# EAGLE design audio (EAGLE 8.6.0)
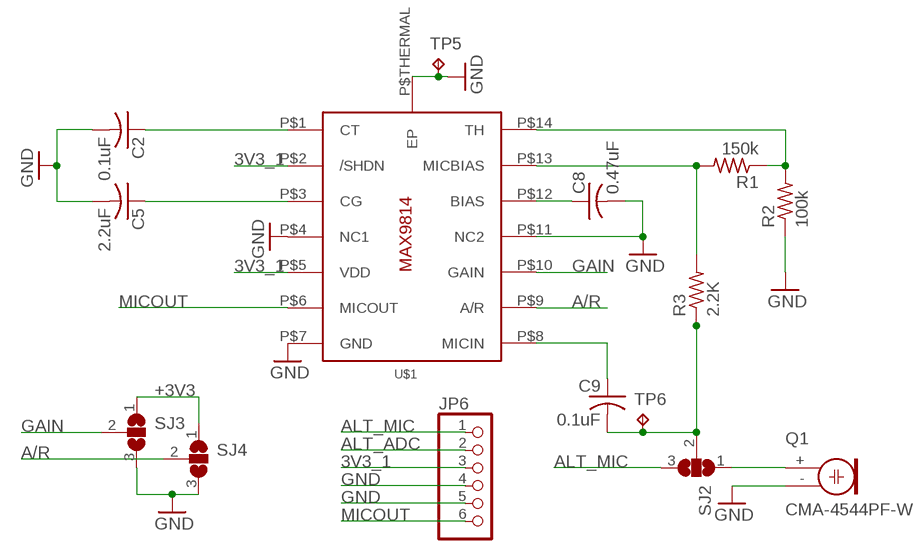
[diagram p0: schematic, sheet 1]

## Parts
C2  0.1uF  C-USC0805K  [C0805K]
C5  2.2uF  C-USC0805K  [C0805K]
C8  0.47uF  C-USC0805K  [C0805K]
C9  0.1uF  C-USC0805K  [C0805K]
JP6  PINHD-1X6  [1X06]
Q1  CMA-4544PF-W  ELECTRET  [9.7ELECTRET]
R1  150k  R-US_R0805  [R0805]
R2  100k  R-US_R0805  [R0805]
R3  2.2K  R-US_R0805  [R0805]
SJ2  SJ2W  [SJ_2]
SJ3  SJ2W  [SJ_2]
SJ4  SJ2W  [SJ_2]
TP5  TPB1,27  [B1,27]
TP6  TPB1,27  [B1,27]
U$1  MAX9814TDFN14  [TDFN14_3X3MM]

## Nets
3V3_1: JP6.3 U$1.P$2(/SHDN) U$1.P$5(VDD)
+3V3: SJ3.1 SJ4.1
A/R: SJ4.2 U$1.P$9(A/R)
ALT_ADC: JP6.2
ALT_MIC: JP6.1 SJ2.3
GAIN: SJ3.2 U$1.P$10(GAIN)
GND: C2.2 C5.2 C8.2 JP6.4 JP6.5 Q1.- R2.1 SJ3.3 SJ4.3 TP5.TP U$1.P$4(NC1) U$1.P$7(GND) U$1.P$11(NC2) U$1.P$THERMAL(EP)
INPUT: C9.2 R3.1 SJ2.2 TP6.TP
MICOUT: JP6.6 U$1.P$6(MICOUT)
N$5: C9.1 U$1.P$8(MICIN)
N$7: C8.1 U$1.P$12(BIAS)
N$8: C2.1 U$1.P$1(CT)
N$9: C5.1 U$1.P$3(CG)
N$10: R1.1 R2.2 U$1.P$14(TH)
N$11: R1.2 R3.2 U$1.P$13(MICBIAS)
N$33: Q1.+ SJ2.1

## Library data of the parts
C2 C5 C8 C9 = adafruit:C-US: CAPACITOR, American symbol
JP6 = adafruit:PINHD-1X6: PIN HEADER
Q1 = adafruit:ELECTRET: Electret microphone Thru hole 2.54mm spacing with 9.7mm diameter
R1-R3 = adafruit:R-US_: RESISTOR, American symbol
SJ2-SJ4 = jumper:SJ2W: SMD solder JUMPER
TP5 TP6 = testpad:TP: Test pad
U$1 = adafruit:MAX9814

## Net classes
0 default: clearance 0.205 mm

## Board
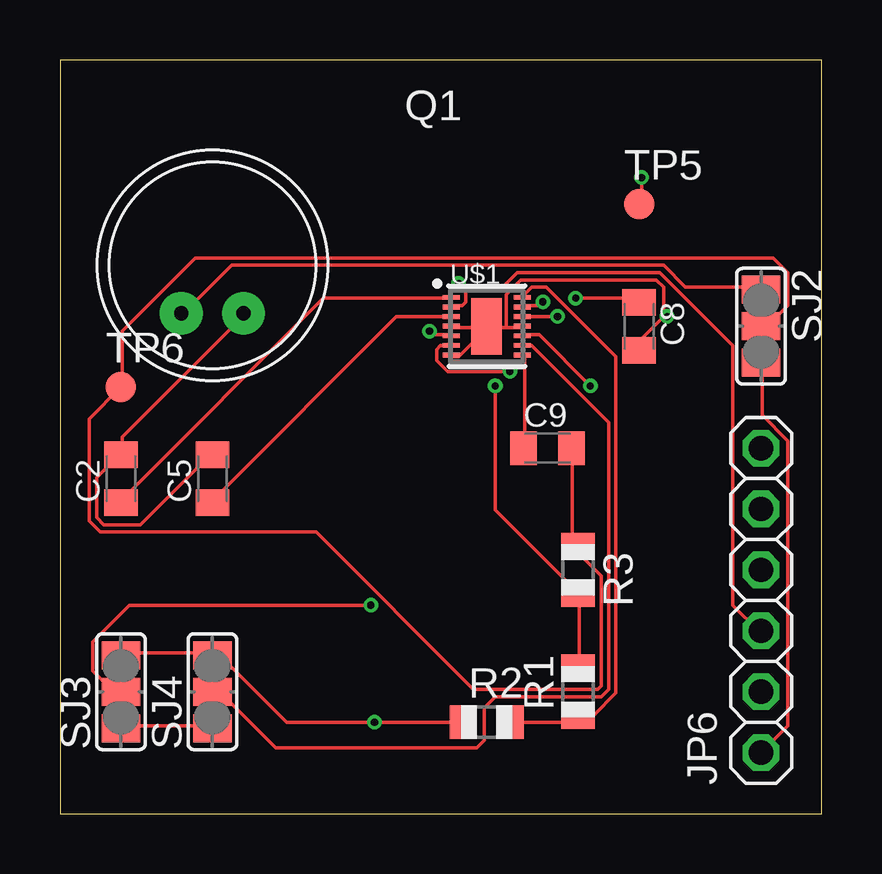
[diagram p1: board, top side]
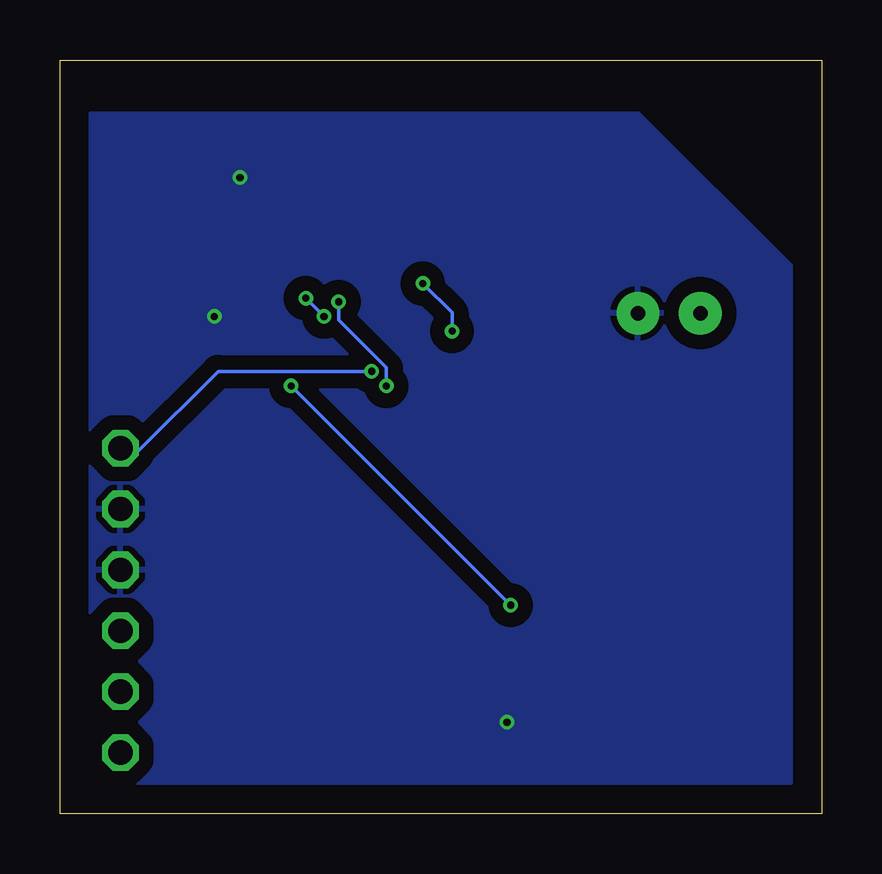
[diagram p2: board, bottom side, seen from below]

Size 31.73 x 31.42 mm. Coordinates in mm from the lower left corner, seen from the top.
Outline: 0,0 31.73,0 31.73,31.42 0,31.42 0,0
Copper layers (1*16): Top 0.035mm / dielectric 1.5mm / Bottom 0.035mm
Design rules "PCBWay_2layer": minimum track width 6mil, minimum drill 0.3mm, track to track 6mil, track to pad 6mil, pad to pad 6mil, via to via 6mil, smd to smd 4mil, copper to edge 10mil, drill to drill 6mil, minimum pad ring 6mil, minimum via ring 6mil, stop-mask expansion 4mil, vias tented up to drill 0.8mm, thermal gap 10mil

### Footprints (pad centres in the part's own frame; a part is rotated, then mirrored left to right if it is on the bottom)
C0805K = smd 1.1 x 1.4: 1 -1,0; 2 1,0
1X06 = drill 1.016 octagon: 1 -6.35,0; 2 -3.81,0; 3 -1.27,0; 4 1.27,0; 5 3.81,0; 6 6.35,0
9.7ELECTRET = drill 0.6 pad 1.778: + 1.3,2; - -1.3,2
R0805 = smd 1.1 x 1.4: 1 -1,0; 2 1,0
SJ_2 = smd 1.168 x 1.6: 1 -1.524,0; 2 0,0; 3 1.524,0
B1,27 = smd 1.27 x 1.27: TP 0,0
TDFN14_3X3MM = smd 0.7 x 0.2: P$1 -1.475,1.2; P$2 -1.475,0.8; P$3 -1.475,0.4; P$4 -1.475,0; P$5 -1.475,-0.4; P$6 -1.475,-0.8; P$7 -1.475,-1.2; P$8 1.475,-1.2; P$9 1.475,-0.8; P$10 1.475,-0.4; P$11 1.475,0; P$12 1.475,0.4; P$13 1.475,0.8; P$14 1.475,1.2 | smd 1.27 x 2.35: P$THERMAL 0,0

### Placement (x,y rotation side)
C2  2.54,13.97 90 top
C5  6.35,13.97 90 top
C8  24.13,20.32 270 top
C9  20.32,15.24 0 top
JP6  29.21,8.89 90 top
Q1  6.35,22.86 180 top
R1  21.59,5.08 90 top
R2  17.78,3.81 0 top
R3  21.59,10.16 270 top
SJ2  29.21,20.32 270 top
SJ3  2.54,5.08 90 top
SJ4  6.35,5.08 90 top
TP5  24.13,25.4 0 top
TP6  2.54,17.78 0 top
U$1  17.78,20.32 0 top

### Tracks (layer width: path | path; a pad name or v marks a point on that pad's centre or on a via)
3V3_1  (via drill 0.3)
  Top 0.152: v15.39,20.12 15.54,19.96 16.15,19.96 U$1.P$5 | 16.92,21.79 v16.61,22.1 | 16.92,21.79 16.92,21.34 16.76,21.18 16.31,21.18 U$1.P$2 | 16.92,21.79 18.29,21.79 19.05,22.55 24.99,22.55 28.04,19.51 28.04,8.69 29.11,7.62 JP6.3
  Bottom 0.152: v15.39,20.12 15.39,20.88 v16.61,22.1
+3V3
  Top 0.152: SJ3.1 2.59,3.66 6.25,3.66 SJ4.1
A/R
  Top 0.152: U$1.P$9 19.36,19.51 19.66,19.51 22.86,16.31 22.86,5.18 22.55,4.88 18.14,4.88 17.68,4.42 17.68,3.05 17.37,2.74 8.99,2.74 6.71,5.03 6.4,5.03 SJ4.2
ALT_MIC
  Top 0.152: JP6.1 30.33,3.66 30.33,15.54 29.26,16.61 29.26,18.74 SJ2.3
GAIN  (via drill 0.3)
  Top 0.152: v22.1,17.83 19.96,19.96 19.36,19.96 U$1.P$10 | v12.95,8.69 2.9,8.69 1.37,7.16 1.37,5.94 2.13,5.18 2.44,5.18 SJ3.2
  Bottom 0.152: v12.95,8.69 v22.1,17.83
GND  (via drill 0.3)
  Top 0.152: R2.1 v13.11,3.81 9.45,3.81 6.71,6.55 6.4,6.55 SJ4.3 6.25,6.71 2.59,6.71 SJ3.3 | 17.83,20.27 16.61,19.05 16.31,19.05 U$1.P$7 | U$1.P$4 16.31,20.27 17.68,20.27 U$1.P$THERMAL 17.83,20.27 | 17.83,20.27 18.59,20.27 | 18.59,20.27 19.2,20.27 U$1.P$11 | 25.15,20.73 24.23,19.81 24.23,19.36 C8.2 | 25.15,20.73 25.15,21.95 24.84,22.25 19.2,22.25 18.59,21.64 18.59,20.27 | v24.23,26.52 24.23,25.45 TP5.TP | Q1.- 7.62,20.73 2.59,15.7 2.59,15.09 C2.2 2.44,14.93 1.52,14.02 1.52,12.34 1.83,12.04 3.35,12.04 6.25,14.93 C5.2 | v25.3,20.73 25.15,20.73
  pour Bottom (isolate 0.61): 1.27,22.86 7.62,29.21 30.48,29.21 30.48,1.27 1.27,1.27
INPUT
  Top 0.152: C9.2 21.34,15.24 21.34,11.43 21.49,11.28 R3.1 21.64,11.12 21.64,10.82 22.55,9.91 22.55,5.33 22.4,5.18 17.22,5.18 10.67,11.73 1.68,11.73 1.22,12.19 1.22,16.46 TP6.TP 2.59,17.83 2.59,20.12 5.64,23.16 29.72,23.16 30.33,22.55 30.33,21.18 29.57,20.42 29.26,20.42 SJ2.2
MICOUT  (via drill 0.3)
  Top 0.152: v18.75,18.44 16.15,18.44 15.7,18.9 15.7,19.36 15.85,19.51 16.15,19.51 U$1.P$6
  Bottom 0.152: v18.75,18.44 25.15,18.44 28.5,15.09 28.96,15.09 29.11,15.24 JP6.6
N$5
  Top 0.152: U$1.P$8 19.36,19.05 19.36,15.24 C9.1
N$7  (via drill 0.3)
  Top 0.152: v20.73,20.73 19.36,20.73 U$1.P$12 | v21.49,21.49 23.93,21.49 24.08,21.34 C8.1
  Bottom 0.152: v21.49,21.49 v20.73,20.73
N$8
  Top 0.152: U$1.P$1 16.15,21.49 10.97,21.49 2.59,13.11 C2.1
N$9
  Top 0.152: U$1.P$3 16.15,20.73 14.02,20.73 6.4,13.11 C5.1
N$10
  Top 0.152: U$1.P$14 19.2,21.49 19.66,21.95 20.27,21.95 23.16,19.05 23.16,5.03 22.25,4.11 21.64,4.11 R1.1 21.49,3.96 21.34,3.81 R2.2
N$11  (via drill 0.3)
  Top 0.152: v20.12,21.34 19.96,21.18 19.36,21.18 U$1.P$13 | v18.14,17.83 18.14,12.65 21.49,9.3 R3.2 21.64,9.14 21.64,6.1 R1.2
  Bottom 0.152: v20.12,21.34 20.12,20.57 18.14,18.59 v18.14,17.83
N$33
  Top 0.152: SJ2.1 29.11,21.95 26.06,21.95 25.15,22.86 7.16,22.86 5.18,20.88 Q1.+